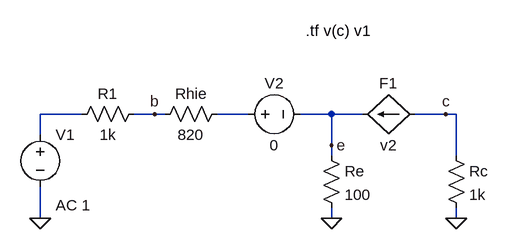
[diagram p0: schematic modelo h de tbj.asc]
modelo h de tbj.asc, the LTspice schematic file:
Version 4
SHEET 1 880 680
WIRE 0 160 -64 160
WIRE 112 160 80 160
WIRE 128 160 112 160
WIRE 256 160 208 160
WIRE 384 160 336 160
WIRE 432 160 384 160
WIRE 560 160 512 160
WIRE 576 160 560 160
WIRE -64 192 -64 160
WIRE 384 208 384 160
WIRE 384 224 384 208
WIRE 576 224 576 160
WIRE -64 320 -64 272
WIRE 384 320 384 304
WIRE 576 320 576 304
FLAG 384 320 0
FLAG 576 320 0
FLAG -64 320 0
FLAG 560 160 c
FLAG 112 160 b
FLAG 384 208 e
SYMBOL res 224 144 R90
WINDOW 0 0 56 VBottom 2
WINDOW 3 32 56 VTop 2
SYMATTR InstName Rhie
SYMATTR Value 820
SYMBOL voltage -64 176 R0
WINDOW 123 24 124 Left 2
WINDOW 39 0 0 Left 0
SYMATTR Value2 AC 1
SYMATTR InstName V1
SYMATTR Value ""
SYMBOL res 96 144 R90
WINDOW 0 0 56 VBottom 2
WINDOW 3 32 56 VTop 2
SYMATTR InstName R1
SYMATTR Value 1k
SYMBOL voltage 240 160 R270
WINDOW 0 32 56 VTop 2
WINDOW 3 -32 56 VBottom 2
WINDOW 123 0 0 Left 0
WINDOW 39 0 0 Left 0
SYMATTR InstName V2
SYMATTR Value 0
SYMBOL f 512 160 R90
WINDOW 0 -32 40 VBottom 2
WINDOW 3 32 40 VTop 2
SYMATTR InstName F1
SYMATTR Value v2
SYMATTR Value2 200
SYMBOL res 368 208 R0
SYMATTR InstName Re
SYMATTR Value 100
SYMBOL res 560 208 R0
SYMATTR InstName Rc
SYMATTR Value 1k
TEXT 344 32 Left 2 !.tf v(c) v1

The netlist it stands for:
* modelo h de tbj.asc
Rhie N002 b 820
V1 N001 0 AC 1
R1 b N001 1k
V2 N002 e 0
F1 c e v2 200
Re e 0 100
Rc c 0 1k
.tf v(c) v1
.backanno
.end